# EAGLE design KELU1-0234 (EAGLE 7.6.0)
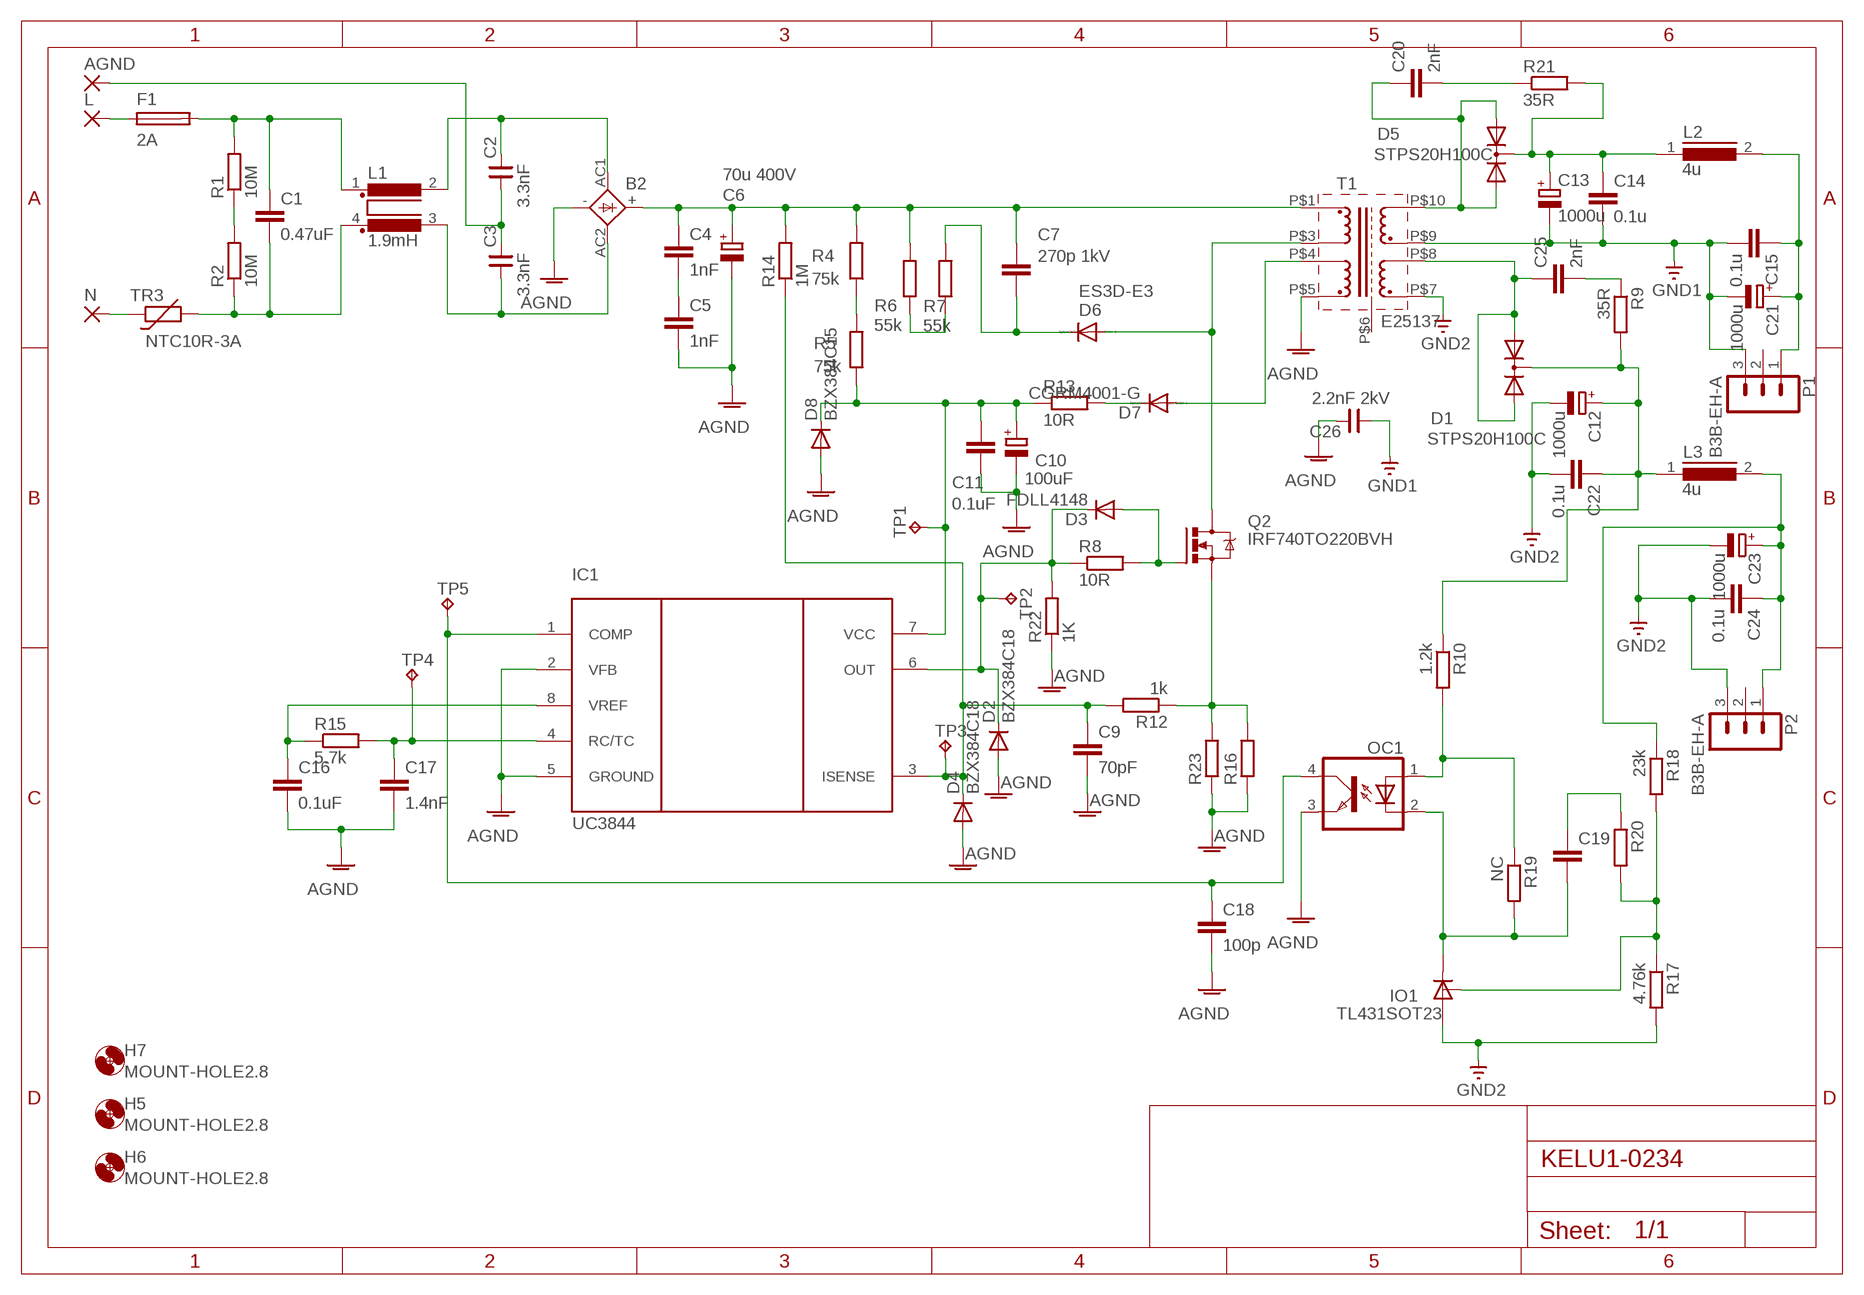
[diagram p0: schematic, sheet 1]

## Parts
AGND  3,17/1,1  [3,17/1,1]
B2  2KBP  [2KBP]
C1  0.47uF  C15/5  [C15B5]
C2  3.3nF  CNP-C085-110X050  [C085-110X050]
C3  3.3nF  CNP-C080-110X045  [C080-110X045]
C4  1nF  C-EUC1206K  [C1206K]
C5  1nF  C-EUC1206K  [C1206K]
C6  70u 400V  CPOL-EUE7.5-16  [E7,5-16]
C7  270p 1kV  C-EUC1206K  [C1206K]
C9  70pF  C-EUC0805K  [C0805K]
C10  100uF  CPOL-EUE5-5  [E5-5]
C11  0.1uF  C-EUC0805K  [C0805K]
C12  1000u  CPOL-EUE3.5-8  [E3,5-8]
C13  1000u  CPOL-EUE3.5-8  [E3,5-8]
C14  0.1u  C-EUC0805K  [C0805K]
C15  0.1u  C-EUC0805K  [C0805K]
C16  0.1uF  C-EUC0805K  [C0805K]
C17  1.4nF  C-EUC0805K  [C0805K]
C18  100p  C-EUC0805K  [C0805K]
C19  C-EUC0805K  [C0805K]
C20  2nF  C-EUC1206K  [C1206K]
C21  1000u  CPOL-EUE3.5-8  [E3,5-8]
C22  0.1u  C-EUC0805K  [C0805K]
C23  1000u  CPOL-EUE3.5-8  [E3,5-8]
C24  0.1u  C-EUC0805K  [C0805K]
C25  2nF  C-EUC1206K  [C1206K]
C26  2.2nF 2kV  CNP-C080-110X045  [C080-110X045]
D1  STPS20H100C  BYV32  [TO220ABS]
D2  BZX384C18  DIODE-SOD323-W  [SOD323-W]
D3  FDLL4148  DIODE-MINIMELF  [MINIMELF]
D4  BZX384C18  DIODE-SOD323-W  [SOD323-W]
D5  STPS20H100C  BYV32  [TO220ABS]
D6  ES3D-E3  DIODE-SMC  [SMC]
D7  CGRM4001-G  [SOD-123_MINI-SMA]
D8  BZX384C15  DIODE-SOD323-W  [SOD323-W]
F1  2A  FUSETE5  [TE5]
H5  MOUNT-HOLE2.8  [2,8]
H6  MOUNT-HOLE2.8  [2,8]
H7  MOUNT-HOLE2.8  [2,8]
IC1  UC3844  [SOIC08]
IO1  TL431SOT23  [SOT23]
L  3,17/1,1  [3,17/1,1]
L1  1.9mH  MFE  [MFE]
L2  4u  82114R  [82114R]
L3  4u  82114R  [82114R]
N  3,17/1,1  [3,17/1,1]
OC1  PC817  [DIL04]
P1  B3B-EH-A  [B3B-EH-A]
P2  B3B-EH-A  [B3B-EH-A]
Q2  IRF740TO220BVH  [TO220BVH]
R1  10M  R-EU_M1206  [M1206]
R2  10M  R-EU_M1206  [M1206]
R4  75k  R-EU_M1206  [M1206]
R5  75k  R-EU_M1206  [M1206]
R6  55k  R-EU_M1206  [M1206]
R7  55k  R-EU_M1206  [M1206]
R8  10R  R-EU_M1206  [M1206]
R9  35R  R-EU_M1206  [M1206]
R10  1.2k  R-EU_R0805W  [R0805W]
R12  1k  R-EU_R0805W  [R0805W]
R13  10R  R-EU_R0805W  [R0805W]
R14  1M  R-EU_M1206  [M1206]
R15  5.7k  R-EU_R0805W  [R0805W]
R16  R-EU_R2512  [R2512]
R17  4.76k  R-EU_R0805W  [R0805W]
R18  23k  R-EU_R0805W  [R0805W]
R19  NC  R-EU_R0805W  [R0805W]
R20  R-EU_R0805W  [R0805W]
R21  35R  R-EU_M1206  [M1206]
R22  1K  R-EU_M1206  [M1206]
R23  R-EU_R2512  [R2512]
T1  E25137  [E25137]
TP1  TPB1,27  [B1,27]
TP2  TPB1,27  [B1,27]
TP3  TPB1,27  [B1,27]
TP4  TPB1,27  [B1,27]
TP5  TPB1,27  [B1,27]
TR3  NTC10R-3A  THERMISTOR-5  [R-5]

## Nets
AGND: B2.- C5.2 C6.- C9.2 C10.- C11.2 C16.2 C17.2 C18.2 C26.2 D2.A D4.A D8.A IC1.2(VFB) IC1.5(GROUND) OC1.3(EMIT) R16.1 R22.1 R23.1 T1.P$5
GND1: C13.- C14.2 C15.2 C21.- C26.1 P1.3 T1.P$9
GND2: C12.- C22.2 C23.- C24.2 IO1.3(A) P2.3 R17.2 T1.P$7
N$1: F1.1 L.1(P)
N$2: C1.1 F1.2 L1.1 R1.2
N$3: C1.2 L1.4 R2.1 TR3.2
N$4: R1.1 R2.2
N$5: AGND.1(P) C2.1 C3.2
N$6: N.1(P) TR3.1
N$7: B2.AC1 C2.2 L1.2
N$8: B2.AC2 C3.1 L1.3
N$9: B2.+ C4.1 C6.+ C7.1 R4.2 R6.2 R14.2 T1.P$1
N$10: C4.2 C5.1
N$11: D6.A Q2.D T1.P$3
N$12: D3.A Q2.G R8.2
N$13: R4.1 R5.2
N$14: D2.C D3.C IC1.6(OUT) R8.1 R22.2 TP2.PP(TP)
N$15: R6.1 R7.1
N$16: C10.+ C11.1 D8.C IC1.7(VCC) R5.1 R13.1 TP1.PP(TP)
N$17: C7.2 D6.C R7.2
N$18: C12.+ C22.1 D1.C L3.1 R9.2 R10.1
N$19: Q2.S R12.1 R16.2 R23.2
N$20: D7.C R13.2
N$21: D7.A T1.P$4
N$22: C9.1 D4.C IC1.3(ISENSE) R12.2 R14.1 TP3.PP(TP)
N$23: OC1.1(A) R10.2 R19.1
N$24: C16.1 IC1.8(VREF) R15.1
N$25: C17.1 IC1.4(RC/TC) R15.2 TP4.PP(TP)
N$26: C20.1 D5.A1 D5.A2 T1.P$10
N$28: C13.+ C14.1 D5.C L2.1 R21.2
N$29: C15.1 C21.+ L2.2 P1.1
N$30: C18.1 IC1.1(COMP) OC1.4(COL) TP5.PP(TP)
N$31: IO1.2(R) R17.1 R18.2 R20.2
N$32: C19.1 R20.1
N$33: C20.2 R21.1
N$34: C19.2 IO1.1(C) OC1.2(C) R19.2
N$35: C25.1 D1.A1 D1.A2 T1.P$8
N$36: C25.2 R9.1
N$37: C23.+ C24.1 L3.2 P2.1 R18.1
Unconnected: P1.2 P2.2 T1.P$6

## Library data of the parts
AGND L N = wirepad:3,17/1,1: THROUGH-HOLE PAD
B2 = rectifier:2KBP: RECTIFIER grid 3 x 3,81 mm
C1 = capacitor-wima:C: CAPACITOR naming: grid - package width
C2 C3 C26 = cap-master:CNP-: NON-POLARIZED CAP
C4 C5 C7 C20 C25 = rcl:C-EU: CAPACITOR, European symbol
C6 = rcl:CPOL-EU: POLARIZED CAPACITOR, European symbol
C9 C11 C14-C19 C22 C24 = resistor:C-EU: CAPACITOR, European symbol
C10 C12 C13 C21 C23 = resistor:CPOL-EU: POLARIZED CAPACITOR, European symbol
D1 D5 = diode:BYV32: DIODE 2 x Si diode 200 V, 20 A/230 Apeak, 25 ns
D2-D4 D8 = diode-1:DIODE-: DIODE
D6 = diode:DIODE-: DIODE
D7 = diode:CGRM400*-G: Molded plasitc,JEDEC SOD-123/Mini SMA Source: Comchip CGRM4001-G.pdf
F1 = fuse:FUSE: Fuse
H5-H7 = holes:MOUNT-HOLE: MOUNTING HOLE with drill center marker
IC1 = UC3844:UC3844: Current-Mode PWM Controller
IO1 = references:TL431: Programmable Shunt Regulator TL431 Features > Programmable Output Voltage to 36 Volts > Low Dynamic Output Impedance 0.2? Typical > Sink Current Capability of 1.0 to 100mA > Equivalent Full-Range Temperature Coefficient of 50ppm/°C Typical > Temperature Compensated For Operation Over Full Rated Operating Temperature Range > Low Output Noise Voltage > Fast Turn-on Response; MPN: TL431BFDT; OC_FARNELL: 2095471; PACKAGE: SOT23; SUPPLIER: NXP
L1 = inductors:MFE: FILTER
L2 L3 = inductors:82114R: INDUCTOR
OC1 = optocoupler:PC817: SHARP OPTO COUPLER
P1 P2 = con-jst-eh:B3B-EH-A: HEADER
Q2 = transistor-power:IRF740: N-CHANNEL MOS FET
R1 R2 R4-R7 R9 R14 R16 R21 R23 = rcl:R-EU_: RESISTOR, European symbol
R8 R10 R12 R13 R15 R17-R20 R22 = resistor:R-EU_: RESISTOR, European symbol
T1 = E25137:E25137: E-25/13/7 Transformer
TP1-TP5 = testpad:TP: Test pad
TR3 = varistor:THERMISTOR: THERMISTOR

## Board
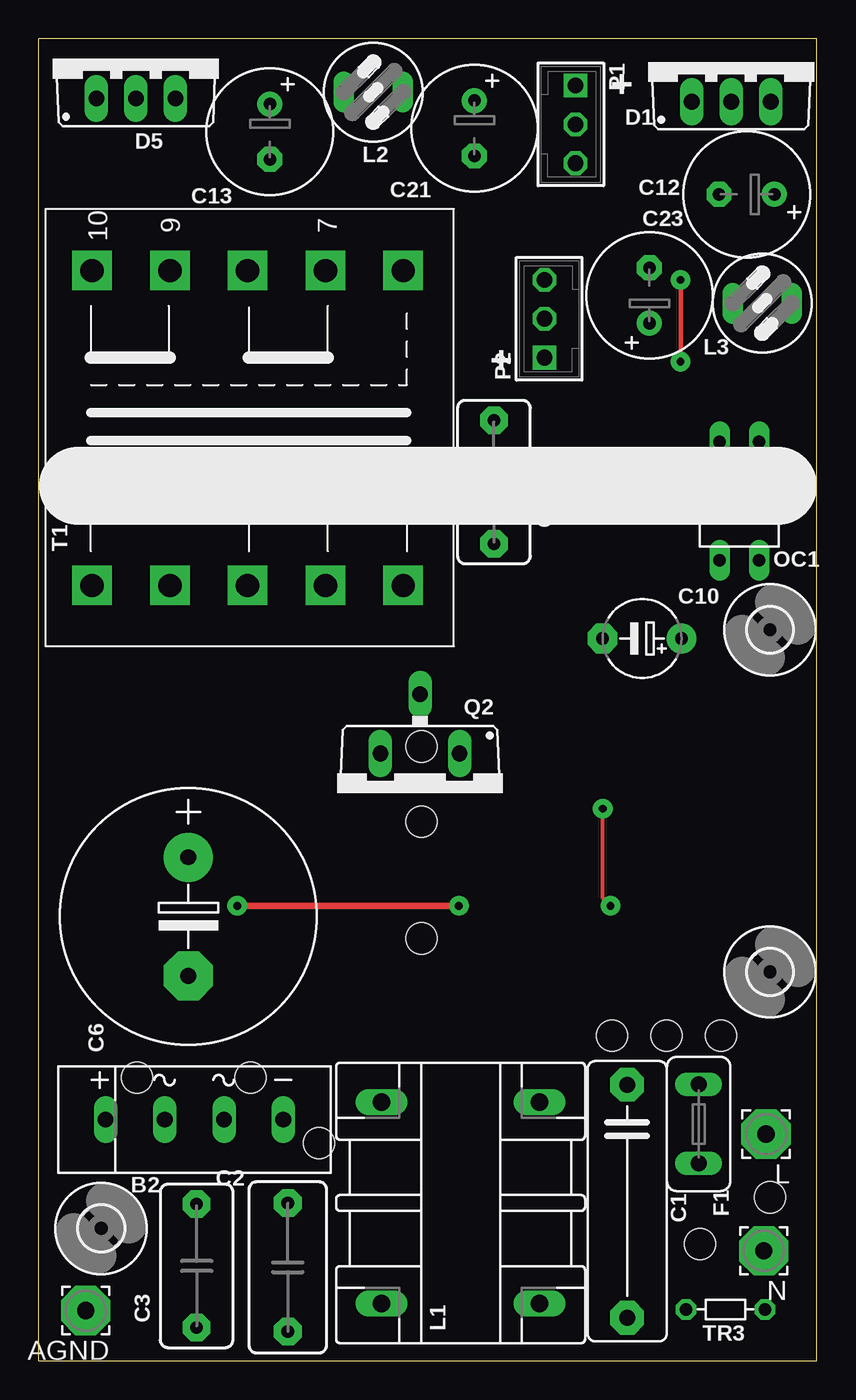
[diagram p1: board, top side]
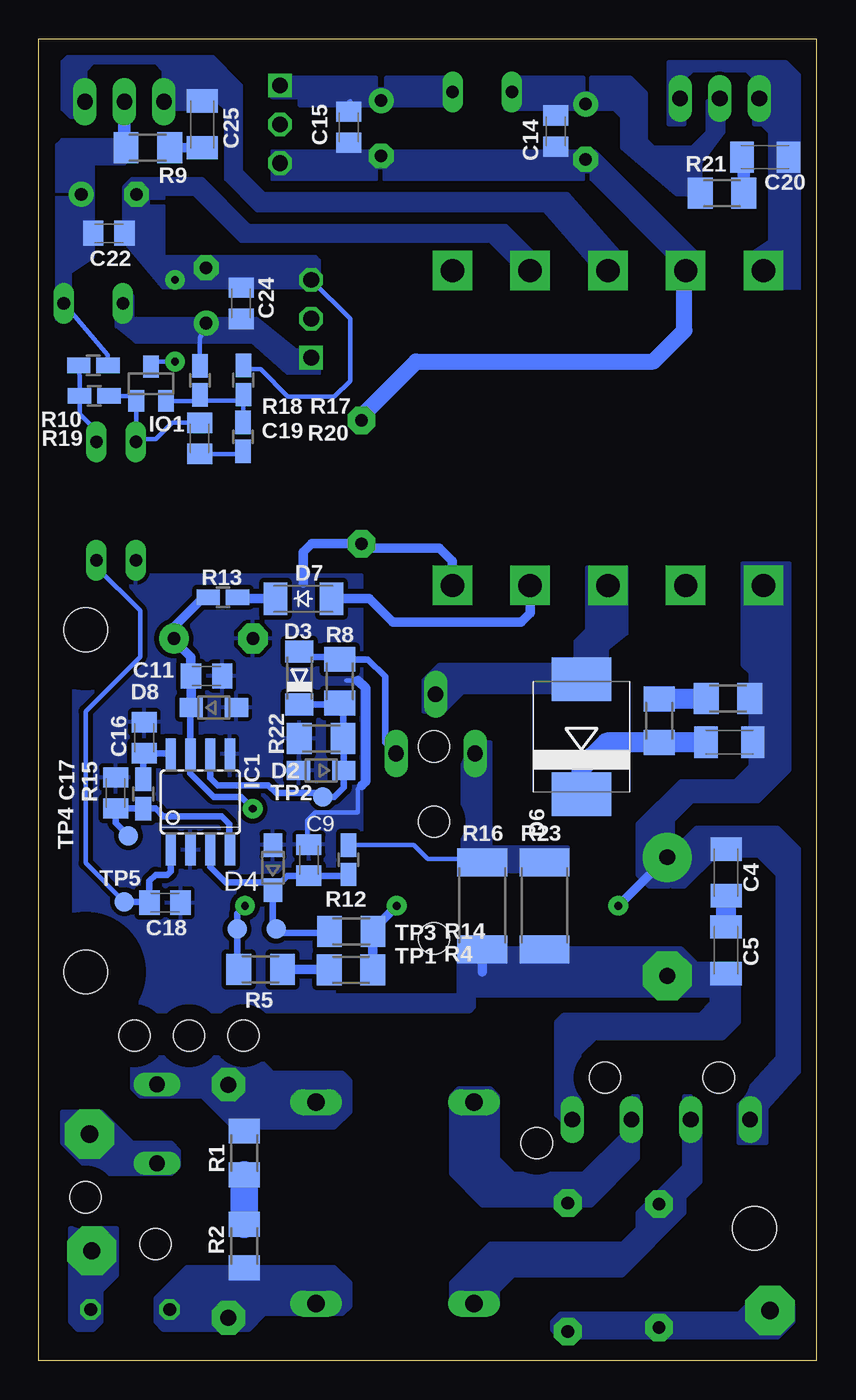
[diagram p2: board, bottom side, seen from below]

Size 50 x 85 mm. Coordinates in mm from the lower left corner, seen from the top.
Outline: 0,0 50,0 50,85 0,85 0,0
Copper layers (1*16): Top 0.035mm / dielectric 1.5mm / Bottom 0.035mm
Design rules "default": minimum track width 10mil, minimum drill 24mil, track to track 8mil, track to pad 8mil, pad to pad 8mil, via to via 8mil, smd to smd 8mil, copper to edge 40mil, drill to drill 8mil, minimum pad ring 10mil, minimum via ring 8mil, stop-mask expansion 4mil, vias tented up to drill 0mil, thermal gap 10mil
Holes 2 mm at 47,10.5 42.5,7.5 18,14 6.3,18.2 13.6,18.2 24.6,39.5 24.6,34.65 24.6,27.15 36.85,20.9 40.35,20.9 43.85,20.9

### Footprints (pad centres in the part's own frame; a part is rotated, then mirrored left to right if it is on the bottom)
3,17/1,1 = drill 1.118 pad 3.175 octagon: 1 0,0
2KBP = drill 1.016 long: + 5.715,0; - -5.715,0; AC1 -1.905,0; AC2 1.905,0
C15B5 = drill 1.016 pad 2.159 octagon: 1 -7.493,0; 2 7.493,0
C085-110X050 = drill 0.813 pad 1.778 octagon: 1 -4.128,0; 2 4.128,0
C080-110X045 = drill 0.813 pad 1.778 octagon: 1 -3.969,0; 2 3.969,0
C1206K = smd 1.5 x 2: 1 -1.5,0; 2 1.5,0
E7,5-16 = drill 1.016 pad 3.15: + -3.81,0 | drill 1.016 pad 3.15 octagon: - 3.81,0
C0805K = smd 1.3 x 1.6: 1 -1,0; 2 1,0
E5-5 = drill 0.813 pad 1.905: + -2.54,0 | drill 0.813 pad 1.905 octagon: - 2.54,0
E3,5-8 = drill 0.813 pad 1.6: + -1.778,0 | drill 0.813 pad 1.6 octagon: - 1.778,0
TO220ABS = drill 1.016 long: A1 -2.54,-2.54; A2 2.54,-2.54; C 0,-2.54
SOD323-W = smd 1.5 x 1.2: A 1.45,0; C -1.45,0
MINIMELF = smd 1.4 x 1.8: A 1.7,0; C -1.7,0
SMC = smd 2.8 x 3.8: A 3.7,0; C -3.7,0
SOD-123_MINI-SMA = smd 1.5 x 2.1: A 1.8,0; C -1.8,0
TE5 = drill 1.016 long: 1 -2.54,0; 2 2.54,0
2,8 = hole 2.8: 0,0
SOIC08 = smd 0.66 x 2.032: 1 -1.905,-3.073; 2 -0.635,-3.073; 3 0.635,-3.073; 4 1.905,-3.073; 5 1.905,3.073; 6 0.635,3.073; 7 -0.635,3.073; 8 -1.905,3.073
SOT23 = smd 1 x 1.4: 1 -0.95,-1.1; 2 0.95,-1.1; 3 0,1.1
MFE = drill 1.118 long: 1 6.477,-5.08; 2 6.477,5.08; 3 -6.477,5.08; 4 -6.477,-5.08
82114R = drill 0.813 long: 1 0,1.905; 2 0,-1.905
DIL04 = drill 0.813 long: 1 -1.27,-3.81; 2 1.27,-3.81; 3 1.27,3.81; 4 -1.27,3.81
B3B-EH-A = drill 1.016 square: 1 -2.5,0 | drill 1.016 octagon: 2 0,0; 3 2.5,0
TO220BVH = drill 1.016 long: D 0,-6.35; G -2.54,-2.54; S 2.54,-2.54
M1206 = smd 1.6 x 2: 1 -1.4,0; 2 1.4,0
R0805W = smd 1.5 x 1: 1 -0.94,0; 2 0.94,0
R2512 = smd 1.8 x 3.2: 1 -2.8,0; 2 2.8,0
E25137 = drill 1.5 pad 2.54 square: P$1 -10.15,10.08; P$2 -10.15,5.08; P$3 -10.15,0.08; P$4 -10.15,-4.92; P$5 -10.15,-9.92; P$6 10.1,-9.92; P$7 10.1,-4.92; P$8 10.1,0.08; P$9 10.1,5.08; P$10 10.1,10.08
B1,27 = smd 1.27 x 1.27: PP 0,0
R-5 = drill 0.813 octagon: 1 -2.54,0; 2 2.54,0

### Placement (x,y rotation side)
AGND  3.01,3.21 180 top
B2  10,15.5 180 top
C1  37.82,10.25 270 top
C2  16,6 90 top
C3  10.14,6.09 270 top
C4  5.82,31.39 270 bottom
C5  5.83,26.39 270 bottom
C6  9.61,28.56 270 top
C7  5.61,39.77 180 bottom
C9  32.64,32.18 90 bottom
C10  38.78,46.44 180 top
C11  39.22,44.03 0 bottom
C12  45.5,75 180 top
C13  14.85,79.03 270 top
C14  16.77,79.07 270 bottom
C15  30.08,79.32 270 bottom
C16  43.23,40.06 90 bottom
C17  45.07,36.51 90 bottom
C18  41.89,29.45 0 bottom
C19  39.67,59.31 90 bottom
C20  3.31,77.39 180 bottom
C21  28,79.25 270 top
C22  45.5,72.5 0 bottom
C23  39.25,68.5 90 top
C24  37,68 90 bottom
C25  39.5,79.5 270 bottom
C26  29.25,56.5 270 top
D1  44.5,83.5 0 top
D2  31.85,37.95 180 bottom
D3  33.25,43.9 90 bottom
D4  34.95,31.7 90 bottom
D5  6.24,83.71 0 top
D6  15.12,40.12 90 bottom
D7  33,49 0 bottom
D8  38.75,42 0 bottom
F1  42.41,15.22 90 top
H5  4,8.5 0 top
H6  47,47 0 top
H7  47,25 0 top
IC1  39.62,35.93 0 bottom
IO1  42.79,62.82 0 bottom
L  46.75,14.56 180 top
L1  27.11,10.14 90 top
L2  21.5,81.58 90 top
L3  46.5,68 270 top
N  46.6,7.06 180 top
OC1  45.03,55.27 180 top
P1  34.5,79.5 270 top
P2  32.5,67 90 top
Q2  24.5,36.5 180 top
R1  36.79,13.36 90 bottom
R2  36.81,7.36 90 bottom
R4  29.94,25.13 0 bottom
R5  35.74,25.15 0 bottom
R6  5.69,42.57 0 bottom
R7  10.11,41.14 270 bottom
R8  30.65,43.7 90 bottom
R9  43,78 180 bottom
R10  46.5,64 180 bottom
R12  30.1,32.21 270 bottom
R13  38.17,49.09 0 bottom
R14  29.92,27.59 0 bottom
R15  43.29,36.44 270 bottom
R16  21.5,29.25 90 bottom
R17  36.86,63.06 90 bottom
R18  39.65,63.04 270 bottom
R19  46.44,62.04 0 bottom
R20  36.88,59.41 90 bottom
R21  6.08,75.07 180 bottom
R22  31.85,40 0 bottom
R23  17.5,29.25 90 bottom
T1  13.5,60 90 top
TP1  37.25,27.75 0 bottom
TP2  31.75,36.25 0 bottom
TP3  34.75,27.75 0 bottom
TP4  44.25,33.75 0 bottom
TP5  44.5,29.5 0 bottom
TR3  44.13,3.29 180 top

### Tracks (layer width: path | path; a pad name or v marks a point on that pad's centre or on a via)
AGND
  Bottom 0.305: C9.2 32.75,33.29 32.75,34.75 32.25,35.25 29.5,35.25 29.5,36.75 29.25,37 | 29.25,43.5 29.5,43.75 30.25,43.75
  Bottom 0.61: T1.P$5 23.42,51.42 24.25,52.25 28.97,52.25 C26.2 32.47,52.53 33,52 33,50 | R16.1 21.5,25 | 29.25,37 29,37.25 29,43.25 29.5,43.75
  pour Bottom (isolate 0.305): 29.25,50.5 47.75,50.5 47.75,22.5 22.25,22.5 22,22.75 22,23.5 31,23.5 30.75,29 30.75,29.5 29.25,29.5
  pour Bottom (no thermals): 16.75,14.5 16.75,21.75 16.25,22.25 7.5,22.25 6.75,23 6.75,24.5 5,24.5 5,21.75 6,20.75 14.25,20.75 15.25,19.75 15.25,14.5
  pour Bottom (no thermals): 23,26.5 8.75,26.5 7.75,25.5 6.25,25.5 6.25,23.5 23,23.5
GND1
  Bottom 1.016: C26.1 29.25,60.75 25.75,64.25 10.5,64.25 8.5,66.25 8.5,70.02 T1.P$9
  pour Bottom (no thermals): 7.5,69 7.5,71 14.25,77.75 35,77.75 35,76 28.3,76 28.3,76.75 27.8,76.75 27.8,76 15,76 15,76.5 14.5,76.5 14.5,76 9.5,71 9.5,69
GND2  (via drill 0.5 pad 1.27)
  Top 0.305: v41.25,64.25 v41.25,69.5
  Bottom 0.305: R17.2 36.61,63.75 35.75,63.75 34,62 31,62 30,63 30,67 P2.3 | IO1.3 42.46,64.25 v41.25,64.25 | v41.25,69.5 41.5,69.5
  pour Bottom (no thermals): 17.5,70.5 17.5,69 19.5,69 19.5,70.5 21,72 37,72 40,75 42,75 42,74.75 43,74.75 43,74.25 42,74.25 42,71 32.25,71 32,70.75 32,69 42,69 44.5,72 44.5,75.5 44,76 39.5,76 36.5,73 20,73
N$1
  pour Bottom (no thermals): 41.5,12 46.5,12 48.5,14 48.5,16 46,16 44,14 41.5,14 41,13.5 41,12.5
N$2
  pour Bottom (no thermals): 44,17.5 43.5,17 39.5,17 37.5,15 31,15 30,16 30,18 30.5,18.5 35,18.5 36,19.5 43.5,19.5 44,19
N$3
  pour Bottom (no thermals): 31,6 40.5,6 42.5,4 42.5,2.5 42,2 36.5,2 35.5,3 30.5,3 30,3.5 30,5
N$4
  Bottom 1.778: R1.1 36.81,11.96 R2.2
N$5
  pour Bottom (no thermals): 17,2.5 16.5,3 5,3 3.5,4.5 2.5,4.5 1.5,3.5 1.5,2.5 2.5,1.5 16.5,1.5 17,2
N$6
  pour Bottom (no thermals): 48,3 48,8.5 45,8.5 45,5.5 46,4.5 46,2.5 46.5,2 47.5,2 48,2.5
N$7
  pour Bottom (no thermals): 20.5,17 20.5,13 19.5,12 15,12 12.5,14.5 12.5,17 11.5,17 11.5,13 14.5,10 21.5,10 23.5,12 23.5,17 23,17.5 21,17.5
N$8
  pour Bottom (no thermals): 8.5,17 8.5,12.5 11.5,9.5 11.5,8.5 12.5,7.5 21,7.5 23.5,5 23.5,3.5 23,3 21,3 20.5,3.5 20.5,4.5 19.5,5.5 12.5,5.5 8.5,9.5 8.5,10.5 7.5,11.5 7.5,17
N$9  (via drill 0.5 pad 1.27)
  Top 0.406: v27,29.25 v12.75,29.25
  Bottom 0.61: R4.2 28.54,27.57 R14.2 28.52,27.73 v27,29.25 | v12.75,29.25 9.63,32.37 C6.+
  pour Bottom (no thermals): 5,14 3.25,14 3.25,16.25 1,18.75 1,32.75 2.5,34.25 7.75,34.25 9.5,32.5 9.5,30.75 9.25,30.5 8.5,30.5 6.5,32.5 3.75,32.5 2.5,31.25 2.5,19.5 5,16.75
  pour Bottom (no thermals): 9.25,30.75 9.25,34.75 8,36 3.75,36 1.75,38 1.75,51.25 4.75,51.25 4.75,44.75 4.25,44.25 4.25,38.25 5.25,37.25 8.75,37.25 11.5,34.5 11.5,31.25 10.75,30.5 9.5,30.5
N$10
  Bottom 1.27: C4.2 C5.1
N$11
  pour Bottom (no thermals): 12.25,51 12.25,46.75 13.5,45.75 13.5,45.25 14,44.5 15.5,44.5 15.5,46.25 14.75,47 14.75,51
  pour Bottom (no thermals): 24.25,44.75 25.25,43.75 25.25,41.75 24,41.75 22.75,43 15.75,43 15.75,44.75
N$12
  Bottom 0.406: D3.A arc-39 32.25,45.25 30.8,45.25 R8.2 28.85,45.1 27.75,44 27.75,39.75 Q2.G
N$13
  Bottom 0.61: R4.1 31.36,25.15 R5.2
N$14
  Bottom 0.406: 30.65,42.2 D3.C 33.3,42.25 | 30.65,42.2 R8.1 | 30.65,42.2 30.45,42.2 R22.2 30.4,40 D2.C 30.4,36.85 31,36.25 TP2.PP 32,36.5 34.75,36.5 35.25,37 38.5,37 38.98,37.48 IC1.6
N$15
  Bottom 1.27: R6.1 7.12,42.54 R7.1
N$16  (via drill 0.5 pad 1.27)
  Top 0.254: v36.75,29.25 36.25,29.75 v36.25,35.5
  Bottom 0.406: R5.1 37.25,25.26 TP1.PP 37.25,28.75 v36.75,29.25 | v36.25,35.5 37,36.25 38.75,36.25 40.26,37.76 IC1.7 40.26,41.95 D8.C
  Bottom 0.61: R13.1 39.41,49.09 41.32,47.18 C10.+ 41.32,46.32 40.25,45.25 40.25,44.06 C11.1 40.2,44.01 D8.C
N$17
  Bottom 1.27: C7.2 7.14,39.74 R7.2 13.5,39.75 15.12,38.13 D6.C
N$18
  Bottom 0.305: L3.1 45.56,64.66 R10.1
  Bottom 0.813: D1.C 44.5,78.5 44.4,78.4 R9.2
  pour Bottom (no thermals): 44,78.5 48.5,78.5 49,78 49,75.25 48,75.25 48,74.75 49,74.75 49,67 48,67 48,70 46.5,71 46.5,77 44.5,77 44,77.5
N$19
  Bottom 0.305: 30,33.25 R12.1 25.9,33.15 25,32.25 21.7,32.25 R16.2
  pour Bottom (no thermals): 16,33 16,31.5 22.75,31.5 22.75,39.75 21,39.75 21,33
N$20
  Bottom 0.61: D7.C 37.14,49 R13.2
N$21
  Bottom 0.61: T1.P$4 18.42,48.08 19,47.5 27.25,47.5 28.75,49 D7.A
N$22
  Bottom 0.406: R12.2 30.19,31.18 C9.1 34.02,31.18 D4.C | D4.C 34.95,27.95 TP3.PP arc-90 34.5,27.5 31.41,27.5 R14.1 | D4.C 35.45,30.75 38,30.75 38.98,31.73 IC1.3
N$23
  Bottom 0.305: R10.2 47.38,63.19 R19.1 47.38,60.88 46.3,59.8 OC1.1
N$24
  Bottom 0.406: IC1.8 41.58,39.06 C16.1 43.29,39 R15.1
N$25
  Bottom 0.406: IC1.4 37.75,32.89 37.75,34.5 38.25,35 42,35 42.5,35.5 R15.2 C17.1 45.07,34.57 TP4.PP
N$26
  pour Bottom (no thermals): 2,83.5 9.5,83.5 9.5,79.5 8.5,79.5 8.5,82.5 8,83 4.5,83 4,82.5 4,79.5 3.5,79.5 3,79 3,72 4.5,71 4.5,69 1,69 1,82.5
N$28
  pour Bottom (no thermals): 7.5,77 7.5,75 9,75 12.5,78 12.5,80 13,80.5 20,80.5 20,82.5 15,82.5 15,81.5 14.5,81.5 14.5,82.5 12,82.5 11,81.5 11,78.5 10.5,78 8,78 7,79 7,81 6,81 6,79
N$29
  Bottom 0.305: C15.1 30.08,80.92 30,81
  pour Bottom (no thermals): 23,82.5 27.7,82.5 27.7,81.75 28.3,81.75 28.3,82.5 35,82.5 35,81.25 33.25,81.25 33.25,80.75 23,80.75
N$30
  Bottom 0.305: OC1.4 46.3,51.05 43.5,48.25 43.5,45.25 47,41.75 47,32 TP5.PP
  Bottom 0.406: TP5.PP 42.94,29.5 C18.1 42.89,30.86 42.5,31.25 41.75,31.25 41.52,31.48 IC1.1
N$31
  Bottom 0.305: IO1.2 40.03,61.72 R18.2 arc-90 39.3,61.75 37.23,61.75 arc-90 R17.1 36.86,60.37 arc90 R20.2
N$32
  Bottom 0.305: R20.1 37.04,58.31 C19.1
N$33
  Bottom 0.813: C20.2 4.68,77.39 R21.1
N$34
  Bottom 0.305: C19.2 41.44,60.31 42.5,59.25 43.59,59.25 OC1.2 43.74,59.1 IO1.1 44.06,62.04 R19.2
N$35
  pour Bottom (no thermals): 12.25,69 12.25,70.75 16,75 35.5,75 37,76.5 37,82 39,84 48,84 48.5,83.5 48.5,80.5 48,80 47,80 47,83 46.5,83.5 42.5,83.5 42,83 42,81 41.5,80.5 40,80.5 39.5,81 38.5,81 38,80.5 38,76 36,74 17.5,74 14.5,70.5 14.5,69.25 14.25,69
N$36
  Bottom 0.61: C25.2 R9.1
N$37
  Bottom 0.305: C23.+ 39.65,65.72 R18.1
  pour Bottom (no thermals): 32,65 32,63.5 34,63.5 36.25,65.5 43.75,65.5 45,66.5 45,68.5 44,68.5 44,67 36,67 33.5,65

### Text on the board
tPlace: + | +